# EAGLE schematic MQ (EAGLE 9.6.2)
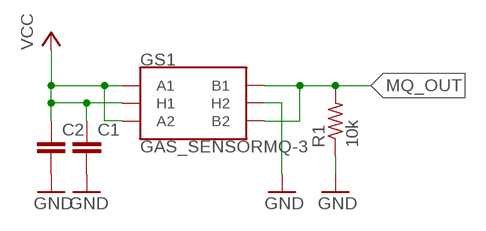
[diagram p0: schematic, sheet 1]

## Parts
C1  C-EUC0603  [C0603]
C2  C-EUC0603  [C0603]
GS1  GAS_SENSORMQ-3  [GAS_SENSOR]
R1  10k  R-US_R0603  [R0603]

## Nets
GND: C1.2 C2.2 GS1.HB(H2) R1.1
MQ_OUT: GS1.B1 GS1.B2 R1.2
VCC: C1.1 C2.1 GS1.A1 GS1.A2 GS1.HA(H1)

## Library data of the parts
C1 C2 = rcl:C-EU: CAPACITOR, European symbol; SPICEPREFIX: C
GS1 = SparkFun-Sensors:GAS_SENSOR: Gas Sensors - MQ-3, MQ-4, MQ-6, MQ-7, MQ-8 Through-hole gas sensors with a heating coil and an analog output. Example Datasheet <https://cdn.sparkfun.com/datasheets/Sensors/Biometric/MQ-3%20ver1.3%20-%20Manual.pdf> SparkFun Products Gas Sensor Breakout Board <https://www.sparkfun.com/products/8891> (BOB-8891) - Breakout board compatible with all gas sensors. Alcohol Gas Sensor - MQ-3 <https://www.sparkfun.com/products/8880> (SEN-08880) Methane CNG Gas Sensor - MQ-4 <https://www.sparkfun.com/products/9404> (SEN-09404) LPG Gas Sensor - MQ-6 <https://www.sparkfun.com/products/9405> (SEN-09405) Carbon Monoxide Sensor - MQ-7 <https://www.sparkfun.com/products/9403> (SEN-09403) Hydrogen Gas Sensor - MQ-8 <https://www.sparkfun.com/products/10916> (SEN-10916); PROD_ID: COMP-12216; SF_ID: SEN-08880
R1 = rcl:R-US_: RESISTOR, American symbol; SPICEPREFIX: R